# Altium schematic sheet Peripheral_Schematic.SchDoc
size A; SheetNumber: 4; SheetTotal: 6
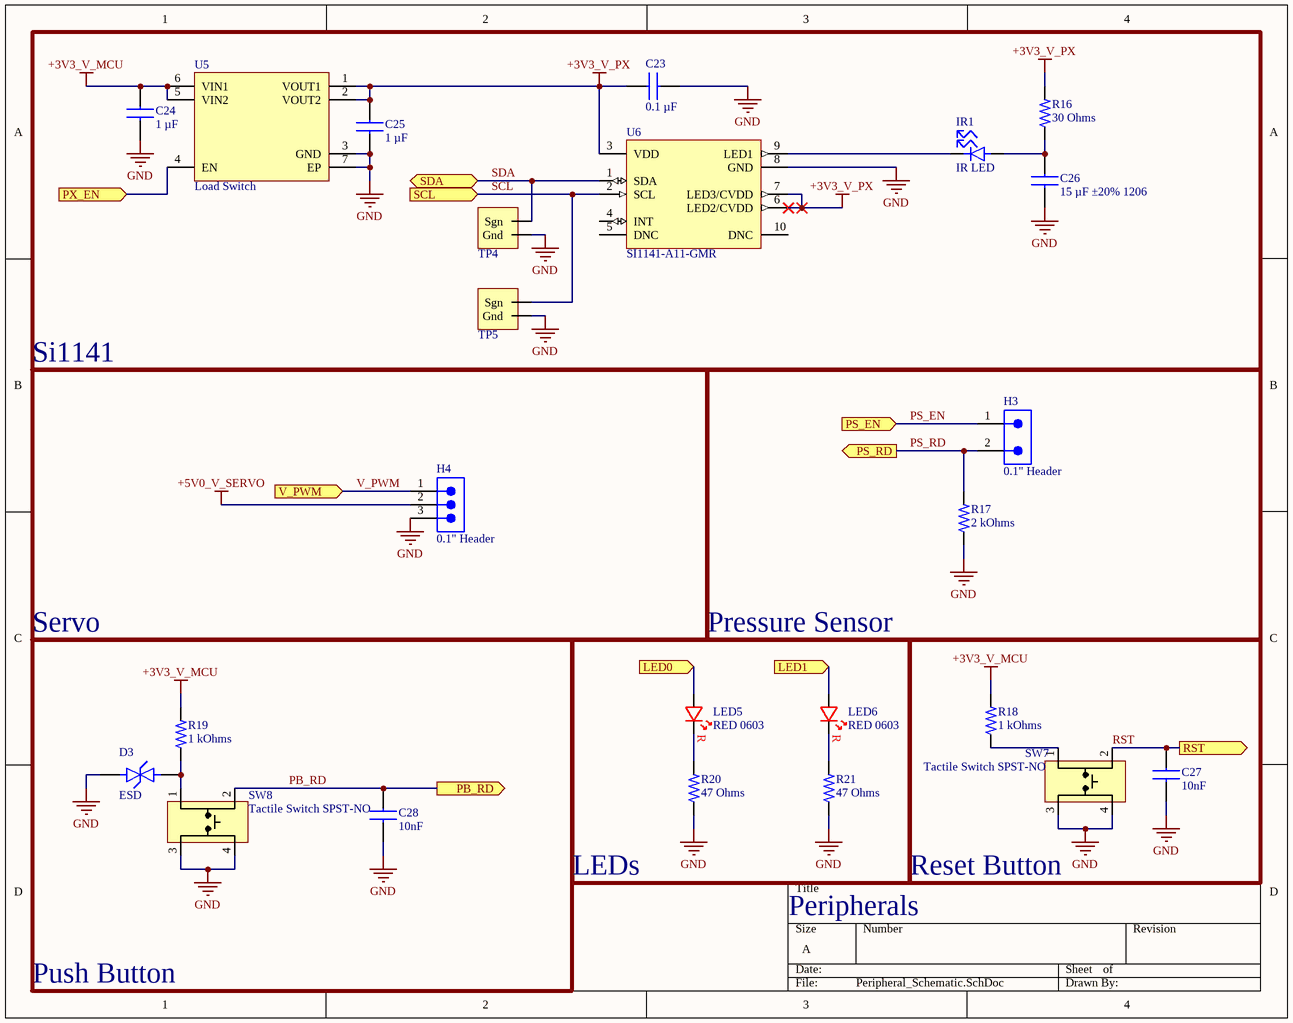
[diagram p0: Peripheral_Schematic.SchDoc]

## Parts
C23  0.1 µF  [CAPC0603X09N]
C24  1 µF  [CAPC0603X10N]
C25  1 µF  [CAPC0603X10N]
C26  15 µF ±20% 1206  [CAP_1206_TDK-M]
C27  10nF  [CAPC0603X09N]
C28  10nF  [CAPC0603X09N]
D3  ESD  [DFN65P100X26-2N]
H3  0.1" Header  [2_PIN_100MIL]
H4  0.1" Header  [3-PIN_MALE_HEADER_01-IN - duplicate]
IR1  IR LED  [LED_THROUGH-HOLE]
LED5  RED 0603  [DIOC0603X06N]
LED6  RED 0603  [DIOC0603X06N]
R16  30 Ohms  [RESC0603X05N-2]
R17  2 kOhms  [RESC0603X05N-1]
R18  1 kOhms  [RESC0603X05N-2]
R19  1 kOhms  [RESC0603X05N-2]
R20  47 Ohms  [RESC0603X06N]
R21  47 Ohms  [RESC0603X06N]
SW7  Tactile Switch SPST-NO  [Switch]
SW8  Tactile Switch SPST-NO  [Switch]
TP4  10x Probe TP  [TP10x_Probe]  (value not drawn)  (no BOM)
TP5  10x Probe TP  [TP10x_Probe]  (value not drawn)  (no BOM)
U5  Load Switch  [SON65P200X60_HS-7N]
U6  SI1141-A11-GMR  [QFN10_2X2_SIL]

## Blocks framed on the sheet
Si1141: C23-C26 IR1 R16 TP4 TP5 U5 U6
Pressure Sensor: H3 R17
Reset Button: C27 R18 SW7

## Ports
LED0 (in), LED1 (in), PB_RD (out), PS_EN (in), PS_RD (out), PX_EN (in), RST (out), SCL (in), SDA (bidir), V_PWM (in)

## Nets
+3V3_V_MCU: C24.1 R18.2 R19.2 U5.5(VIN2) U5.6(VIN1)
+3V3_V_PX: C23.2 C25.1 R16.2 U5.1(VOUT1) U5.2(VOUT2) U6.3(VDD) U6.6(LED2/CVDD) U6.7(LED3/CVDD)
+5V0_V_SERVO: H4.2
GND: C23.1 C24.2 C25.2 C26.2 C27.2 C28.2 D3.1 H4.3 R17.1 R20.1 R21.1 SW7.3 SW7.4 SW8.3 SW8.4 TP4.2(Gnd) TP5.2(Gnd) U5.3(GND) U5.7(EP) U6.8(GND)
LED0: LED5.A ; port LED0
LED1: LED6.A ; port LED1
PB_RD: C28.1 SW8.2 ; port PB_RD
PS_EN: H3.1 ; port PS_EN
PS_RD: H3.2 R17.2 ; port PS_RD
PX_EN: U5.4(EN) ; port PX_EN
RST: C27.1 SW7.2 ; port RST
SCL: TP5.1(Sgn) U6.2(SCL) ; port SCL
SDA: TP4.1(Sgn) U6.1(SDA) ; port SDA
V_PWM: H4.1 ; port V_PWM
NetC26_1: C26.1 IR1.1 R16.1
NetD3_2: D3.2 R19.1 SW8.1
NetIR1_2: IR1.2 U6.9(LED1)
NetLED5_C: LED5.C R20.2
NetLED6_C: LED6.C R21.2
NetR18_1: R18.1 SW7.1

Not connected (* = marked no-connect by the designer): U6 4(INT) 5(DNC) 10(DNC)

## Notes on the sheet
- Servo
- LEDs
- Peripherals
- Push Button
- (in symbol LTST-C191KRKT) R

## Library data of the parts
C23 = C0603C104J4REC7867: Cap Cer 0603 0.1UF 16V X7R 5%; Manufacturer: KEMET; Supplier 1: Digi-Key; Manufacturer Part Number: C0603C104J4REC7867; RoHS: No; Category: Ceramic Capacitors; Stock 1: 12000; Pricing 1: 1=0.16000, 10=0.11300, 50=0.06420, 100=0.05310, 500=0.03724, 1000=0.03083 (USD)
C24 C25 = C0603X105J4RAC7867: Cap Ceramic 1uF 16V X7R 5% SMD 0603 125°C Paper T/R; Manufacturer: KEMET; Supplier 1: Digi-Key; Manufacturer Part Number: C0603X105J4RAC7867; RoHS: No; Category: Ceramic Capacitors; Stock 1: 20000; Pricing 1: 1=0.46000, 10=0.32200, 50=0.24340, 100=0.21210, 500=0.15708, 1000=0.13352 (USD); Mount: Surface Mount; Case/Package: 0603; Case Code (Imperial): 0603; Case Code (Metric): 1608; Min Operating Temperature: -55°C; Max Operating Temperature: 125°C; Features: Soft Termination; Packaging: Tape and Reel; Capacitance: 1uF; Tolerance: 5%; Voltage Rating: 16V; ComponentLink1URL: https://api.kemet.com/component-edge/download/datasheet/C0603X105J4RAC7867.pdf?src-supplier=Digi-Key; ComponentLink1Description: https://api.kemet.com/component-edge/download/datasheet/C0603X105J4RAC7867.pdf?src-supplier=Digi-Key
C26 = C3216X6S1C156M160AC: Cap Ceramic 15uF 16V X6S 20% SMD 1206 105°C Punched Paper T/R; Manufacturer: TDK; Supplier 1: Digi-Key; Manufacturer Part Number: C3216X6S1C156M160AC; RoHS: Yes; Category: Ceramic Capacitors; Stock 1: 1775; Pricing 1: 1=0.94000, 10=0.71500, 50=0.59400, 100=0.51150, 500=0.39600, 1000=0.34100 (USD); Mount: Surface Mount; Case/Package: 1206; Case Code (Metric): 3216; Case Code (Imperial): 1206; Weight: 0.000571oz; Dielectric Material: Ceramic; Min Operating Temperature: -55°C; Max Operating Temperature: 105°C; Package Quantity: 2000; Packaging: Tape and Reel; Capacitance: 15uF; Tolerance: 20%; Voltage Rating: 16V; Dielectric: X6S; Termination: SMD/SMT; Voltage Rating (DC): 16V; Series: C; Length: 0.126inch; Width: 0.063inch; Height: 1.6mm; Thickness: 0.071inch; Lead Free: Lead Free; RoHS Compliant: Yes; ComponentLink1URL: https://datasheet.ciiva.com/14893/tdkmlcccaprange-14893189.pdf?src-supplier=Digi-Key; ComponentLink1Description: https://datasheet.ciiva.com/14893/tdkmlcccaprange-14893189.pdf?src-supplier=Digi-Key
C27 C28 = C0603C103J4RACTU: Cap Ceramic 0.01uF 16V X7R 5% SMD 0603 125°C Paper T/R; Manufacturer: KEMET; Dissipation Factor: 3.5%; Supplier 1: Digi-Key; Manufacturer Part Number: C0603C103J4RACTU; RoHS: Yes; Category: Ceramic Capacitors; Stock 1: 5301; Pricing 1: 1=0.35000, 10=0.24300, 50=0.16200, 100=0.13760, 500=0.09716, 1000=0.08501 (USD); Mount: Surface Mount; Case/Package: 0603; Case Code (Metric): 1608; Case Code (Imperial): 0603; Dielectric Material: Ceramic; Min Operating Temperature: -55°C; Max Operating Temperature: 125°C; Tolerance: 5%; Capacitance: 10nF; Dielectric: X7R; Packaging: Tape and Reel; Voltage Rating: 16V; Package Quantity: 1; Voltage Rating (DC): 16V; Termination: SMD/SMT; Series: C; Construction: Flat; Length: 1.6mm; Width: 0.031inch; Height: 0.8mm; Thickness: 0.034inch; Lead Pitch: 0.7mm; Depth: 0.8mm; Radiation Hardening: No; REACH SVHC: No SVHC; RoHS Compliant: Yes; ComponentLink1URL: https://datasheet.ciiva.com/5417/kem-c1002-x7r-smd-5417414.pdf?src-supplier=Mouser; ComponentLink1Description: https://datasheet.ciiva.com/5417/kem-c1002-x7r-smd-5417414.pdf?src-supplier=Mouser
D3 = ESDL4151MX4T5G: 15 V Bidirectional Low Capacitance ESD Protection Diode for High Speed Data Lines 15V; Manufacturer: ON Semiconductor; Supplier 1: Digi-Key; Manufacturer Part Number: ESDL4151MX4T5G; RoHS: Yes; Category: ESD and Circuit Protection ICs; Stock 1: 6875; Pricing 1: 1=0.49000, 10=0.36900, 100=0.23000, 500=0.15736, 1000=0.12105, 2000=0.10895 (USD); RoHS Compliant: Yes
H3 = PBC01DAAN: CONN HEADER .100 DUAL STR 2POS; Manufacturer: Sullins; Number of Positions: 2; Gender: Male; Connector Type: Male Pin; Row Spacing: 0.1inch; Supplier 1: Digi-Key; Manufacturer Part Number: PBC01DAAN; RoHS: Yes; Category: Connectors; Stock 1: 12443; Pricing 1: 1=0.20000, 10=0.18500, 25=0.15800, 50=0.13820, 100=0.12830, 250=0.11344, 500=0.10852 (USD); Mount: Through Hole; Color: Black; Contact Plating: Gold; Housing Color: Black; Contact Material: Bronze; Housing Material: Plastic; Packaging: Bulk; Number of Rows: 2; Package Quantity: 1; Termination: Solder; Number of Contacts: 2; Contact Type: Male Pin; Length: 2.54mm; Width: 5.08mm; Height: 2.54mm; Contact Mating Length: 0.23inch; Pitch: 0.1inch; Lead Free: Lead Free; RoHS Compliant: Yes; ComponentLink1URL: http://www.sullinscorp.com/catalogs/77_PAGE108-109_.100_MALE_HDR.pdf?src-supplier=Digi-Key; ComponentLink1Description: http://www.sullinscorp.com/catalogs/77_PAGE108-109_.100_MALE_HDR.pdf?src-supplier=Digi-Key; ComponentLink2URL: http://www.sullinscorp.com/catalogs/97_Page78-79_HEADER_.100_2.54mm_MALE_BREAKAWAY.pdf?src-supplier=Future+Electronics; ComponentLink2Description: http://www.sullinscorp.com/catalogs/97_Page78-79_HEADER_.100_2.54mm_MALE_BREAKAWAY.pdf?src-supplier=Future+Electronics
H4 = PRPC003SAAN-RC: CONN HEADER VERT 3POS 2.54MM; Manufacturer: Sullins; Connector Type: Header, Unshrouded, Breakaway; Number of Positions: 3; Number of Positions Loaded: All; Pitch: 0.100" (2.54mm); Online Catalog: 0.100" (2.54mm) Pitch Connector Headers; Other Names: S9510E-03  S9510E-03-ND; Supplier 1: Digi-Key; Manufacturer Part Number: PRPC003SAAN-RC; Stock 1: 19067; Pricing 1: 1=0.12, 10=0.109, 25=0.0812, 50=0.0696, 100=0.0673, 250=0.058, 500=0.0557 (USD); Standard Package: 1; Category: Connectors, Interconnects; Family: Rectangular Connectors - Headers, Male Pins; Series: -; Packaging: Bulk; Contact Type: Male Pin; Number of Rows: 1; Row Spacing: -; Contact Mating Length: 0.230" (5.84mm); Mounting Type: Through Hole; Termination: Solder; Fastening Type: -; Features: -; Contact Finish: Gold; Contact Finish Thickness: Flash; Color: Black; ComponentLink1URL: https://media.digikey.com/PDF/Data%20Sheets/Sullins%20PDFs/xRxCzzzSxxN-RC_ST_11635-B.pdf?src-supplier=Digi-Key; ComponentLink1Description: https://media.digikey.com/PDF/Data%20Sheets/Sullins%20PDFs/xRxCzzzSxxN-RC_ST_11635-B.pdf?src-supplier=Digi-Key; Supplier Part Number 1: S1011EC-03-ND
IR1 = IR333-A: λP=940nm VF=1.2V View Angle=20; Manufacturer: Everlight; Forward Current: 50mA; Wavelength: 940nm; Forward Voltage: 1.2V; Viewing Angle: 20°; Lens Style: Diffused,Colored,Circular; Number of LEDs: 1; Reverse Voltage: 5V; Power Dissipation: 100mW; Test Current: 20mA; Supplier 1: Digi-Key; Manufacturer Part Number: IR333-A; RoHS: Yes; Category: LEDs; Stock 1: 45297; Pricing 1: 1=0.32000, 10=0.25600, 100=0.11500, 500=0.10388, 1000=0.08533, 2000=0.07420, 5000=0.06678, 10000=0.05936, 25000=0.05565 (USD); Mount: Through Hole; Case/Package: Radial; Number of Pins: 2; Min Operating Temperature: -40°C; Max Operating Temperature: 85°C; Packaging: Bulk; Package Quantity: 500; Orientation: Top View; Number of Elements: 1; Series: -; Max Power Dissipation: 100mW; Length: 5.9mm; Depth: 5.9mm; RoHS Compliant: Yes; Lead Free: Lead Free; ComponentLink1URL: https://datasheet.ciiva.com/2107/201407061516067600-2107736.pdf?src-supplier=Digi-Key; ComponentLink1Description: https://datasheet.ciiva.com/2107/201407061516067600-2107736.pdf?src-supplier=Digi-Key; ComponentLink2URL: https://datasheet.ciiva.com/48438/ir333-a-eng-tds-48438869.pdf?src-supplier=Distrelec; ComponentLink2Description: https://datasheet.ciiva.com/48438/ir333-a-eng-tds-48438869.pdf?src-supplier=Distrelec
LED5 LED6 = LTST-C191KRKT: 0603(H=0.65mm) 红色 λD=631nm VR=5V VF=2.0V~2.4V IF=20mA PD=75mW; Manufacturer: Vishay Lite-On; Lens Color: Colorless; Power Rating: 75mW; Luminous Intensity: 54mcd; Viewing Angle: 130°; Forward Voltage: 2V; Lens Style: Clear,Diffused,Colorless,Rectangular; Forward Current: 30mA; Dominant Wavelength: 631nm; Test Current: 20mA; Lens Transparency: Clear; Number of Elements: 1; Wavelength: 639nm; Reverse Voltage: 5V; Supplier 1: Digi-Key; Manufacturer Part Number: LTST-C191KRKT; RoHS: Yes; Category: LEDs; Stock 1: 9; Pricing 1: 1=0.26000, 10=0.14100, 100=0.06560, 500=0.06060, 1000=0.04747, 2000=0.04646 (USD); Mount: Surface Mount; Case/Package: 0603; Number of Pins: 2; Color: Red; Case Code (Metric): 1608; Case Code (Imperial): 0603; Min Operating Temperature: -55°C; Max Operating Temperature: 85°C; Packaging: Tape and Reel; Package Quantity: 1; Illumination Color: Red; Power Dissipation: 75mW; Number of LEDs: 1; Voltage: 2V; Length: 1.6mm; Width: 0.8mm; Height: 0.55mm; Depth: 0.8mm; Radiation Hardening: No; Lead Free: Lead Free; RoHS Compliant: Yes; ComponentLink1URL: https://datasheet.ciiva.com/11773/0900766b80dc02b2-11773601.pdf?src-supplier=RSComponents; ComponentLink1Description: https://datasheet.ciiva.com/11773/0900766b80dc02b2-11773601.pdf?src-supplier=RSComponents; ComponentLink2URL: https://datasheet.ciiva.com/12400/lite-on-ltst-c191krkt-190135-12400910.pdf?src-supplier=Mouser; ComponentLink2Description: https://datasheet.ciiva.com/12400/lite-on-ltst-c191krkt-190135-12400910.pdf?src-supplier=Mouser; ComponentLink3URL: https://datasheet.ciiva.com/16212/ltst-c191krkt-16212419.pdf?src-supplier=Future+Electronics; ComponentLink3Description: https://datasheet.ciiva.com/16212/ltst-c191krkt-16212419.pdf?src-supplier=Future+Electronics; ComponentLink4URL: https://datasheet.ciiva.com/15117/getdatasheetpartid-141922-15117737.pdf?src-supplier=Verical; ComponentLink4Description: https://datasheet.ciiva.com/15117/getdatasheetpartid-141922-15117737.pdf?src-supplier=Verical; ComponentLink5URL: https://datasheet.ciiva.com/2109/s-110-ltst-c191krkt-2109971.pdf?src-supplier=Digi-Key; ComponentLink5Description: https://datasheet.ciiva.com/2109/s-110-ltst-c191krkt-2109971.pdf?src-supplier=Digi-Key; ComponentLink6URL: https://datasheet.ciiva.com/2109/s-110-ltst-c191krkt-2109970.pdf?src-supplier=Digi-Key; ComponentLink6Description: https://datasheet.ciiva.com/2109/s-110-ltst-c191krkt-2109970.pdf?src-supplier=Digi-Key; ComponentLink7URL: https://datasheet.ciiva.com/2109/s-110-ltst-c191krkt-2109972.pdf?src-supplier=Digi-Key; ComponentLink7Description: https://datasheet.ciiva.com/2109/s-110-ltst-c191krkt-2109972.pdf?src-supplier=Digi-Key
R16 = RMCF0603FT30R0: Res Thick Film 0603 30 Ohm 1% 1/10W ±100ppm/°C Molded SMD SMD Paper T/R; Manufacturer: Stackpole Electronics; Resistance: 30R; Max Power Dissipation: 100mW; Supplier 1: Digi-Key; Manufacturer Part Number: RMCF0603FT30R0; RoHS: Yes; Category: Chip SMD Resistors; Stock 1: 3655; Pricing 1: 1=0.10000, 10=0.01700, 100=0.00680, 1000=0.00305, 2500=0.00264 (USD); Mount: Surface Mount; Case/Package: 0603; Case Code (Metric): 1608; Case Code (Imperial): 0603; Contact Plating: Tin,Matte; Min Operating Temperature: -55°C; Max Operating Temperature: 155°C; Package Quantity: 5000; Packaging: Tape and Reel; Tolerance: 1%; Resistor Type: Thick Film; Number of Terminations: 2; Temperature Coefficient: 100ppm/°C; Features: Automotive AEC-Q200; Series: RMCF; Length: 0.061inch; Width: 0.031inch; Height: 0.022inch; Radiation Hardening: No; Lead Free: Contains Lead; RoHS Compliant: Yes; ComponentLink1URL: https://www.seielect.com/catalog/SEI-RMCF_RMCP.pdf?src-supplier=Avnet; ComponentLink1Description: https://www.seielect.com/catalog/SEI-RMCF_RMCP.pdf?src-supplier=Avnet; ComponentLink2URL: https://www.seielect.com/catalog/sei-rmcf_rmcp.pdf?src-supplier=Digi-Key; ComponentLink2Description: https://www.seielect.com/catalog/sei-rmcf_rmcp.pdf?src-supplier=Digi-Key; ComponentLink3URL: https://www.seielect.com/catalog/SEI-Packaging.pdf?src-supplier=Digi-Key; ComponentLink3Description: https://www.seielect.com/catalog/SEI-Packaging.pdf?src-supplier=Digi-Key
R17 = CRCW06032K00FKTA: Res Thick Film 0603 2K Ohm 1% 1/10W ±100ppm/°C Molded SMD SMD Paper T/R; Manufacturer: Vishay Dale; Resistance: 2kR; Power Rating: 100mW; Voltage Rating: 75V; Supplier 1: Digi-Key; Manufacturer Part Number: CRCW06032K00FKTA; RoHS: No; Category: Chip SMD Resistors; Stock 1: 4209; Pricing 1: 1=0.16000, 10=0.13900, 100=0.05350, 1000=0.02353, 2500=0.02032 (USD); Mount: Surface Mount; Case/Package: 0603; Number of Pins: 2; Weight: 7.1E-05oz; Case Code (Imperial): 0603; Case Code (Metric): 1608; Contact Plating: Tin,Lead; Min Operating Temperature: -55°C; Max Operating Temperature: 155°C; Tolerance: 1%; Packaging: Tape and Reel; Package Quantity: 5000; Resistor Type: Thick Film; Number of Terminations: 2; Termination: SMD/SMT; Temperature Coefficient: 100ppm/°C; Max Power Dissipation: 100mW; Power Dissipation: 100mW; Voltage Rating (DC): 75V; Features: Automotive AEC-Q200; Series: CRCW; Construction: Rectangular; Resistance Tolerance: 1%; Length: 1.55mm; Width: 0.033inch; Height: 0.02inch; Depth: 0.85mm; Radiation Hardening: No; Lead Free: Contains Lead; RoHS Compliant: No; REACH SVHC: Unknown; Military Standard: Not; ComponentLink1URL: https://datasheet.ciiva.com/15159/getdatasheetpartid-28881-15159221.pdf?src-supplier=Verical; ComponentLink1Description: https://datasheet.ciiva.com/15159/getdatasheetpartid-28881-15159221.pdf?src-supplier=Verical; ComponentLink2URL: https://datasheet.ciiva.com/9093/dcrcw-9093590.pdf?src-supplier=Avnet; ComponentLink2Description: https://datasheet.ciiva.com/9093/dcrcw-9093590.pdf?src-supplier=Avnet; ComponentLink3URL: https://datasheet.ciiva.com/2565/dcrcw-2565199.pdf?src-supplier=Digi-Key; ComponentLink3Description: https://datasheet.ciiva.com/2565/dcrcw-2565199.pdf?src-supplier=Digi-Key; ComponentLink4URL: https://datasheet.ciiva.com/9094/dcrcw-9094813.pdf?src-supplier=Avnet; ComponentLink4Description: https://datasheet.ciiva.com/9094/dcrcw-9094813.pdf?src-supplier=Avnet
R18 R19 = RMCF0603FT1K00: Res Thick Film 0603 1K Ohm 1% 0.1W(1/10W) ±100ppm/C Pad SMD Automotive T/R; Manufacturer: Stackpole Electronics; Resistance: 1kR; Power Rating: 100mW; Temperature Coefficient: 100ppm/°C; Supplier 1: Digi-Key; Manufacturer Part Number: RMCF0603FT1K00; RoHS: Yes; Category: Chip SMD Resistors; Pricing 1: 1=0.10000, 10=0.01700, 100=0.00680, 1000=0.00305, 2500=0.00264 (USD); Mount: Surface Mount; Case/Package: 0603; Case Code (Metric): 1608; Case Code (Imperial): 0603; Contact Plating: Tin,Matte; Size Code: 0603; Min Operating Temperature: -55°C; Max Operating Temperature: 155°C; Tolerance: 1%; Packaging: Tape and Reel; Resistor Type: Thick Film; Number of Terminations: 2; Max Power Dissipation: 100mW; Features: Automotive AEC-Q200; Series: RMCF; Construction: Rectangular; Length: 1.55mm; Width: 0.031inch; Height: 0.022inch; Depth: 0.8mm; Radiation Hardening: No; Military Standard: Not; Lead Free: Lead Free; RoHS Compliant: Yes; ComponentLink1URL: https://www.seielect.com/catalog/sei-rmcf_rmcp.pdf?src-supplier=Digi-Key; ComponentLink1Description: https://www.seielect.com/catalog/sei-rmcf_rmcp.pdf?src-supplier=Digi-Key; ComponentLink2URL: https://www.seielect.com/catalog/SEI-RMCF_RMCP.pdf?src-supplier=Avnet; ComponentLink2Description: https://www.seielect.com/catalog/SEI-RMCF_RMCP.pdf?src-supplier=Avnet; ComponentLink3URL: https://www.seielect.com/catalog/SEI-Packaging.pdf?src-supplier=Avnet; ComponentLink3Description: https://www.seielect.com/catalog/SEI-Packaging.pdf?src-supplier=Avnet; ComponentLink4URL: https://www.seielect.com/catalog/SEI-Packaging.pdf?src-supplier=Arrow+Electronics; ComponentLink4Description: https://www.seielect.com/catalog/SEI-Packaging.pdf?src-supplier=Arrow+Electronics; ComponentLink5URL: https://www.seielect.com/catalog/SEI-RMCF_RMCP.pdf?src-supplier=Avnet+Asia; ComponentLink5Description: https://www.seielect.com/catalog/SEI-RMCF_RMCP.pdf?src-supplier=Avnet+Asia; ComponentLink6URL: http://www.seielect.com/Catalog/SEI-rmc.pdf?src-supplier=Future+Electronics; ComponentLink6Description: http://www.seielect.com/Catalog/SEI-rmc.pdf?src-supplier=Future+Electronics; ComponentLink7URL: https://www.seielect.com/catalog/SEI-Packaging.pdf?src-supplier=Verical; ComponentLink7Description: https://www.seielect.com/catalog/SEI-Packaging.pdf?src-supplier=Verical; ComponentLink8URL: https://www.seielect.com/catalog/SEI-Packaging.pdf?src-supplier=Quest; ComponentLink8Description: https://www.seielect.com/catalog/SEI-Packaging.pdf?src-supplier=Quest
R20 R21 = CRCW060347R0FKEAC: Res Thick Film 0603 47 Ohm 1% 1/10W ±100ppm/°C Molded SMD Paper T/R; Manufacturer: Vishay Semiconductors; Resistance: 47R; Power Rating: 100mW; Supplier 1: Digi-Key; Manufacturer Part Number: CRCW060347R0FKEAC; RoHS: Yes; Category: Chip SMD Resistors; Stock 1: 3057; Pricing 1: 1=0.10000, 10=0.03600, 100=0.01450, 1000=0.00652, 2500=0.00566 (USD); Mount: Surface Mount; Case/Package: Molded; Contact Plating: Tin; Min Operating Temperature: -55°C; Max Operating Temperature: 155°C; Resistor Type: Thick Film; Termination: Wraparound; Tolerance: 1%; Temperature Coefficient: 100ppm/°C; Length: 1.55mm; Lead Free: Lead Free; RoHS Compliant: Yes; ComponentLink1URL: http://www.vishay.com/docs/28773/crcwce3.pdf?src-supplier=Digi-Key; ComponentLink1Description: http://www.vishay.com/docs/28773/crcwce3.pdf?src-supplier=Digi-Key; ComponentLink2URL: http://www.vishay.com/docs/20035/dcrcwe3.pdf?src-supplier=Avnet+Asia; ComponentLink2Description: http://www.vishay.com/docs/20035/dcrcwe3.pdf?src-supplier=Avnet+Asia
SW7 SW8 = TL3305AF160QG: TL3305A Series SPST 12 V 4.5 x 4.5 mm 160 gf Top Actuated SMT Tactile Switch; Manufacturer: E-Switch; Mechanical Life: 500000Cycles; Illumination Type: Non-Illuminated; Operating Force: 160gf; Switch Travel: 0.2mm; Switch Function: Off-Mom; Actuator Type: Standard; Supplier 1: Digi-Key; Manufacturer Part Number: TL3305AF160QG; RoHS: Yes; Category: Tactile Switches; Stock 1: 727; Pricing 1: 1=0.21000, 10=0.20500, 25=0.19440, 100=0.17600, 250=0.16048, 500=0.14918, 1000=0.12726 (USD); Mount: Surface Mount; Min Operating Temperature: -20°C; Max Operating Temperature: 70°C; Packaging: Tape and Reel; Termination: Gull Wing; Throw Configuration: SPST; Lead Free: Lead Free; RoHS Compliant: Yes; ComponentLink1URL: http://www.farnell.com/datasheets/2554191.pdf?src-supplier=Farnell; ComponentLink1Description: http://www.farnell.com/datasheets/2554191.pdf?src-supplier=Farnell; ComponentLink2URL: http://spec_sheets.e-switch.com/specs/P010468.pdf?src-supplier=Digi-Key; ComponentLink2Description: http://spec_sheets.e-switch.com/specs/P010468.pdf?src-supplier=Digi-Key; ComponentLink3URL: http://www.farnell.com/datasheets/2554191.pdf?src-supplier=Newark; ComponentLink3Description: http://www.farnell.com/datasheets/2554191.pdf?src-supplier=Newark
TP4 TP5 = TP_10x_Probe: Test Point 300 mil centers
U5 = ADP196ACPZN-R7: ICHIGH-SIDELOADSWITCH6LFCSP; Manufacturer: Analog Devices; Number of Outputs: 1; Output Current: 5A; On-State Resistance: 36mR; Turn-On Delay Time: 2ms; Max Supply Current: 4A; Interface: On/Off; Max Output Current: 3A; Operating Supply Current: 250nA; Max Input Voltage: 5.5V; Min Input Voltage: 1.8V; Fault Protection: Over Temperature; Output Configuration: High Side; Supplier 1: Digi-Key; Manufacturer Part Number: ADP196ACPZN-R7; RoHS: Yes; Category: Power Management ICs; Pricing 1: 1=1.72000, 10=1.54500, 25=1.45760, 100=1.24180, 250=1.16600, 500=1.02024, 1000=0.90750 (USD); Mount: Surface Mount; Case/Package: LFCSP EP; Number of Pins: 6; Min Operating Temperature: -40°C; Max Operating Temperature: 85°C; Packaging: Tape and Reel; Package Quantity: 3000; Operating Supply Voltage: 5.5V; Series: -; Radiation Hardening: No; Lead Free: Contains Lead; ComponentLink1URL: http://www.mouser.com/ds/2/609/ADP196-878889.pdf?src-supplier=Mouser; ComponentLink1Description: http://www.mouser.com/ds/2/609/ADP196-878889.pdf?src-supplier=Mouser; ComponentLink2URL: http://components.arrow.com/part/dataview/58949242S513746N2771?src-supplier=Arrow+Electronics; ComponentLink2Description: http://components.arrow.com/part/dataview/58949242S513746N2771?src-supplier=Arrow+Electronics; ComponentLink3URL: http://components.arrow.com/part/dataview/1762_07011809?src-supplier=Arrow+Europe; ComponentLink3Description: http://components.arrow.com/part/dataview/1762_07011809?src-supplier=Arrow+Europe; ComponentLink4URL: http://www.analog.com/static/imported-files/data_sheets/ADP196.pdf?src-supplier=Avnet; ComponentLink4Description: http://www.analog.com/static/imported-files/data_sheets/ADP196.pdf?src-supplier=Avnet; ComponentLink5URL: http://www.analog.com/media/en/technical-documentation/data-sheets/ADP196.pdf?src-supplier=Digi-Key; ComponentLink5Description: http://www.analog.com/media/en/technical-documentation/data-sheets/ADP196.pdf?src-supplier=Digi-Key; ComponentLink6URL: https://www.analog.com/media/en/technical-documentation/data-sheets/ADP196.pdf?src-supplier=Digi-Key; ComponentLink6Description: https://www.analog.com/media/en/technical-documentation/data-sheets/ADP196.pdf?src-supplier=Digi-Key
U6 = SI1141-A11-GMR: Proximity and Ambient Light Sensor Digital Output 1.8V/2.5V/3.3V Automotive 10-Pin QFN T/R; Manufacturer: Silicon Labs; Operating Supply Voltage: 1.8V; Min Supply Voltage: 1.71V; Max Supply Voltage: 3.6V; Sensing Distance: 500mm; Output Type: I2C; Sensing Method: Optical; Output Configuration: Analog; Supplier 1: Digi-Key; Manufacturer Part Number: SI1141-A11-GMR; RoHS: Yes; Category: Optical Sensors; Stock 1: 9895; Pricing 1: 1=7.03000, 5=6.20400, 10=5.48000, 25=4.44640, 50=3.92920, 100=3.82580, 500=3.20540, 1000=2.99860 (USD); Case/Package: QFN; Number of Pins: 10; Min Operating Temperature: -40°C; Max Operating Temperature: 85°C; Package Quantity: 1; Packaging: Tape and Reel; Series: -; Radiation Hardening: No; REACH SVHC: Unknown; RoHS Compliant: Yes; ComponentLink1URL: https://datasheet.ciiva.com/8113/+si114x-8113760.pdf?src-supplier=Avnet; ComponentLink1Description: https://datasheet.ciiva.com/8113/+si114x-8113760.pdf?src-supplier=Avnet; ComponentLink2URL: https://datasheet.ciiva.com/12088/si114x-41368-12088691.pdf?src-supplier=Mouser; ComponentLink2Description: https://datasheet.ciiva.com/12088/si114x-41368-12088691.pdf?src-supplier=Mouser; ComponentLink3URL: https://datasheet.ciiva.com/2819/si114x-2819368.pdf?src-supplier=Digi-Key; ComponentLink3Description: https://datasheet.ciiva.com/2819/si114x-2819368.pdf?src-supplier=Digi-Key; ComponentLink4URL: https://datasheet.ciiva.com/2819/si114x-2819369.pdf?src-supplier=Digi-Key; ComponentLink4Description: https://datasheet.ciiva.com/2819/si114x-2819369.pdf?src-supplier=Digi-Key; ComponentLink5URL: https://datasheet.ciiva.com/2819/si114x-2819370.pdf?src-supplier=Digi-Key; ComponentLink5Description: https://datasheet.ciiva.com/2819/si114x-2819370.pdf?src-supplier=Digi-Key; ComponentLink6URL: https://datasheet.ciiva.com/26808/getdatasheetpartid-567972-26808183.pdf?src-supplier=Verical; ComponentLink6Description: https://datasheet.ciiva.com/26808/getdatasheetpartid-567972-26808183.pdf?src-supplier=Verical